# Altium schematic sheet PP_2_0_3.SchDoc
size 209 x 297 mm; PageSetup: Record=PageOptions|CenterHorizontal=True|CenterVertical=True|PrintScale=0.94|XCorrection=1.00|YCorrection=1.00|PrintKind=2|BorderSize=5000000|LeftOffset=0|BottomOffset=0|Orientation=1|PaperLength=2970|PaperWidth=2100|Scale=100|PaperSource=7|PrintQuality=600|MediaType=1|DitherType=10|PaperKind=A4|PrintScaleMode=1; Title1str: (вторая строка при необходимости); DocumentType: Тип схемы; DocumentNumber: 53251498.468331.01.04.00 Э3; SheetNumber: 4; Format: A4
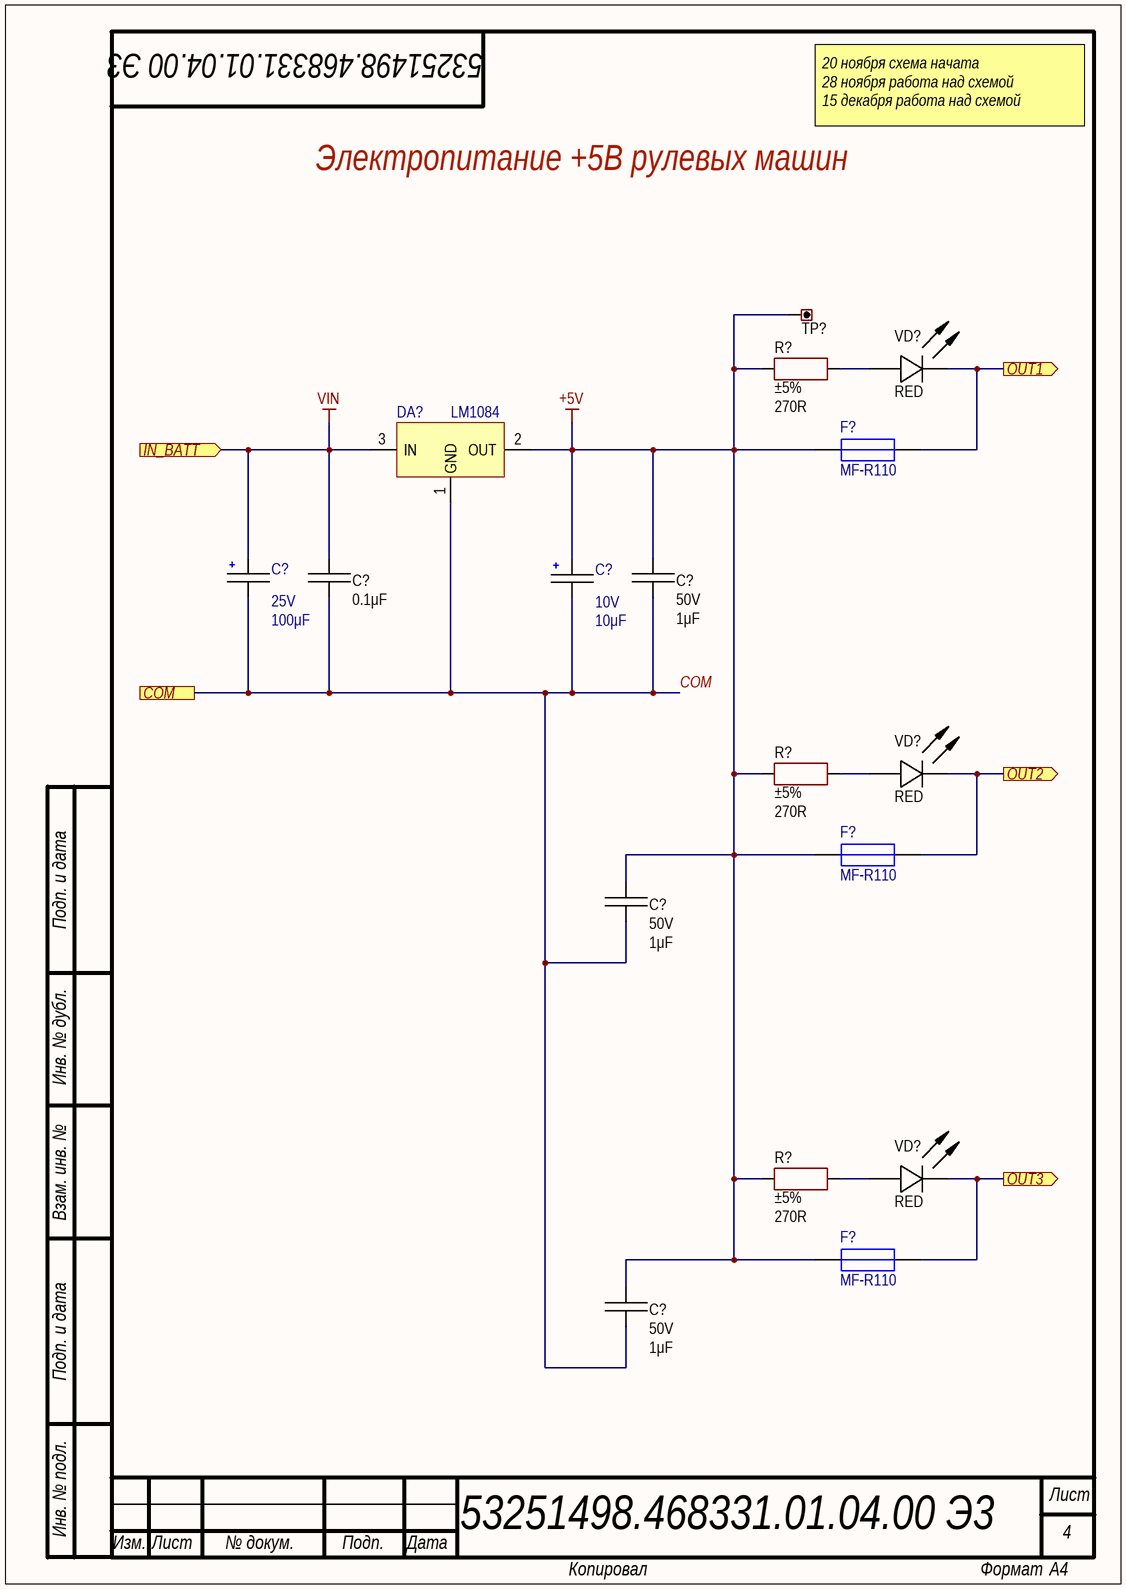
[diagram p0: PP_2_0_3.SchDoc]

## Parts
(Parts that share a designator on the sheet are numbered #1, #2 ... from top to bottom, then left to right.)
C?#1  value 100μF  Voltage: 25V  [CAP: RB2-5]  (hidden comment: Cap Pol1)
C?#2  value 0.1μF  [CAP: 0805, Thru-Hole]
C?#3  value 10μF  Voltage: 10V  [CAP: RB2-5]  (hidden comment: Cap Pol1)
C?#4  value 1μF  Voltage: 50V  [CAP: 1206, Thru-Hole]
C?#5  value 1μF  Voltage: 50V  [CAP: 1206, Thru-Hole]
C?#6  value 1μF  Voltage: 50V  [CAP: 1206, Thru-Hole]
DA?  7805  [TO-220_heatsink]  (value not drawn)
F?#1  MF-R110  [FUSE:MF-R_Style_1]
F?#2  MF-R110  [FUSE:MF-R_Style_1]
F?#3  MF-R110  [FUSE:MF-R_Style_1]
R?#1  value 270R  Tolerance: ±5%  [AXIAL-0.3]
R?#2  value 270R  Tolerance: ±5%  [AXIAL-0.3]
R?#3  value 270R  Tolerance: ±5%  [AXIAL-0.3]
TP?  (no value)  [CON: 5000 (Keystone)]
VD?#1  Color: RED  [LED: 3MM_301_R]
VD?#2  Color: RED  [LED: 3MM_301_R]
VD?#3  Color: RED  [LED: 3MM_301_R]

## Ports
COM, IN_BATT (in), OUT1 (out), OUT2 (out), OUT3 (out)

## Nets
+5V: C?#3.2 C?#4.2 C?#5.2 C?#6.2 DA?.2(OUT) F?#1.1 F?#2.1 F?#3.1 R?#1.1 R?#2.1 R?#3.1 TP?.1
VIN: C?#1.2 C?#2.2 DA?.3(IN) ; port IN_BATT
COM: C?#2.1 C?#3.1 C?#4.1 C?#5.1 C?#6.1 DA?.1(GND) ; port COM
OUT1: F?#1.2 VD?#1.2(C) ; port OUT1
OUT2: F?#2.2 VD?#2.2(C) ; port OUT2
OUT3: F?#3.2 VD?#3.2(C) ; port OUT3
NetR?#1_2: R?#1.2 VD?#1.1(A)
NetR?#2_2: R?#2.2 VD?#2.1(A)
NetR?#3_2: R?#3.2 VD?#3.1(A)

Not connected (* = marked no-connect by the designer): C?#1 1

## Notes on the sheet
- 20 ноября схема начата
  28 ноября работа над схемой
  15 декабря работа над схемой
- Электропитание +5В рулевых машин
- Подп. и дата
- Инв. № дубл.
- Взам. инв. №
- Инв. № подл.
- Лист
- Изм.
- № докум.
- Подп.
- Дата
- Копировал
- Формат

## Library data of the parts
C?#1 C?#3 = Cap Pol1: Polarized Capacitor (Radial); Published: 8-Jun-2000; LatestRevisionDate: 17-Jul-2002; LatestRevisionNote: Re-released for DXP Platform.; PackageReference: RB2-5; Publisher: Altium Limited; PackageDescription: Polarized Capacitor (Radial); 2 Leads
C?#2 = Ceramic_0805: К10-17 0805; Manufacturer: Murata; PartNumber: RPEE41H105M3M1C05A; ValueManufacturerPartNumber: Ceramic capacitor, 0.1μF, X7R, ±10%, 50V, 1206, -55...+125°C; TypeCapacitor: Ceramic capacitor; Tolerance: ±10%; TypeDielectric: X7R; Voltage: 50V; Package: 1206; HelpURL: https://www.chipdip.ru/product/rpee41h105m3; Temperature: -55...+125°C
C?#4-C?#6 = Ceramic_1206: К10-17 1206; Manufacturer: Murata; PartNumber: RPEE41H105M3M1C05A; ValueManufacturerPartNumber: Ceramic capacitor, 1μF, X7R, ±10%, 50V, 1206, -55...+125°C; TypeCapacitor: Ceramic capacitor; Tolerance: ±10%; TypeDielectric: X7R; Package: 1206; HelpURL: https://www.chipdip.ru/product/rpee41h105m3; Temperature: -55...+125°C
DA? = LM1084: 3-Terminal 5V 5-Amp Low-Dropout, Positive Regulator; Note: Pin 2 is electrically connected to tab; Published: 15-Apr-2002; DatasheetVersion: Feb-1988; PackageVersion: Sep-1995; PackageReference: KC03; Publisher: Altium Limited; PackageDescription: TO220, Thru-Hole, Vertical, Heatsink Mounted; 3 In-Line Leads; Pitch 2.54 mm; ComponentLink1Description: Manufacturer Link; ComponentLink1URL: http://www.ti.com/; Type: LM1084
F?#1-F?#3 = Fuse 1A: MF-R110, 1.1 А, Предохранитель самовосстанавливающийся, MultiFuse; Value: 1A; Published: 8-Jun-2000; LatestRevisionDate: 17-Jul-2002; LatestRevisionNote: Re-released for DXP Platform.; PackageReference: MF-R_Style_2; Publisher: Altium Limited; PackageDescription: Thru-Hole; 2 Leads
R?#1-R?#3 = ResistorCF-25: Manufacturer: Yageo; PartNumber: СF-1/4W-100RF; ValueManufacturerPartNumber: Resistor film, 270R, ±5%, CF-25, 0.25W, -55...+125°C; TypeResistor: Resistor film; Power: 0.25W; Package: CF-25; HelpURL: https://www.digikey.com/product-detail/en/yageo/RC0201JR-07100RL/311-100NCT-ND/1949006; Temperature: -55...+125°C
TP? = Connector_Test_Point: Manufacturer: Keystone; ValueManufacturerPartNumber: Test point, Keystone, 5001; PartNumber: 5001; TypeConnector: Test point; HelpURL: https://www.digikey.com/product-detail/en/keystone-electronics/5001/36-5001-ND/255327
VD?#1-VD?#3 = LED_single: ValueManufacturerPartNumber: LED, RED, *, *, *, -55...+150°C; PartNumber: L-1503CB/1ID; TypeDiode: LED; Manufacturer: *; Package: *; HelpURL: *; Temperature: -55...+150°C; Current: *; VoltageDrop: *; ColorParameter: RED